# EAGLE design ADC3_FPGA (EAGLE 9.6.2)
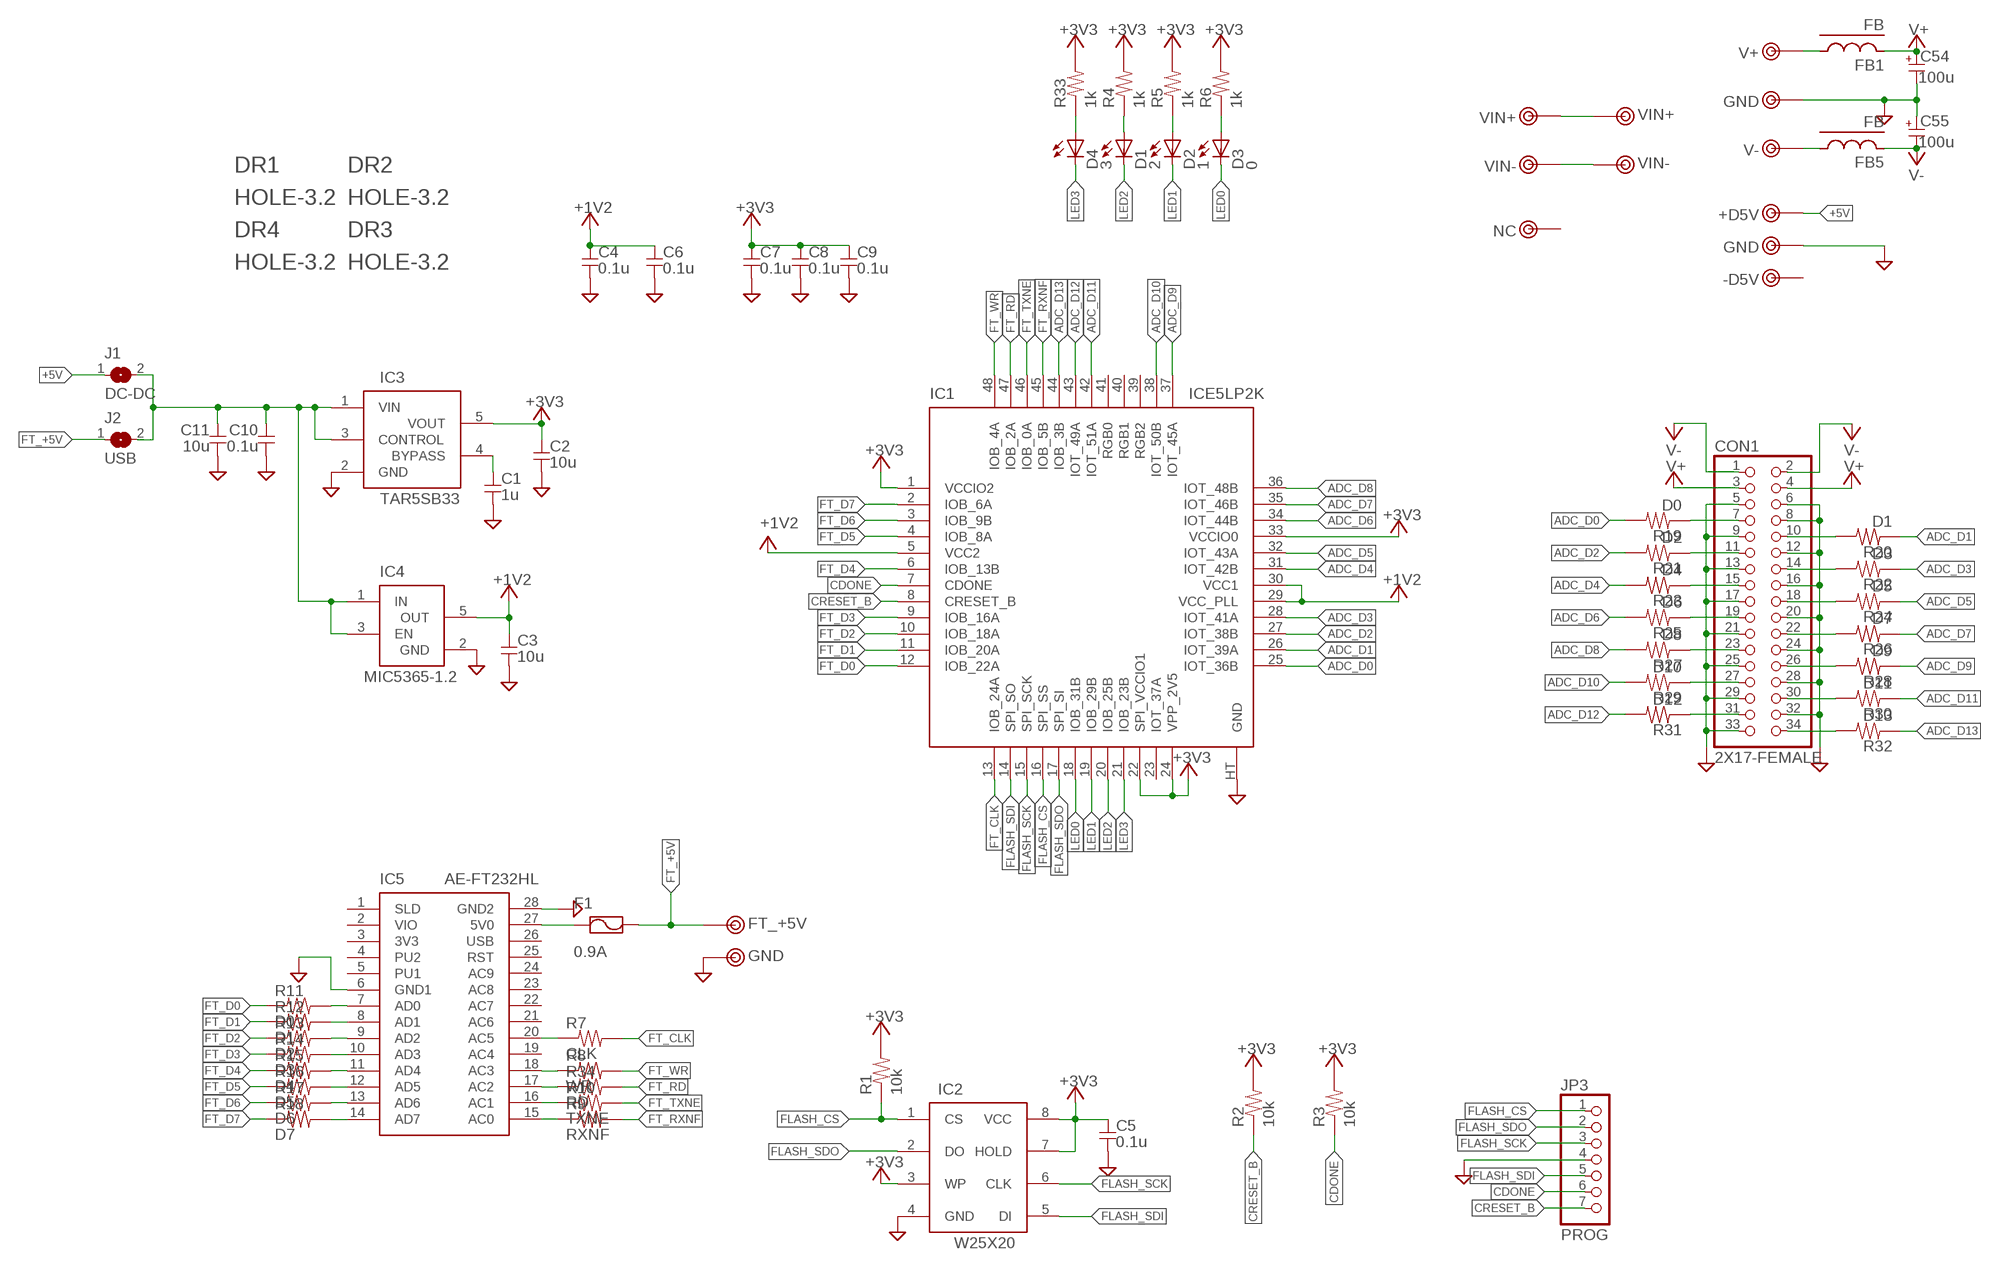
[diagram p0: schematic, sheet 1]

## Parts
C1  1u  C-1608  [1608]
C2  10u  C-2012  [2012]
C3  10u  C-2012  [2012]
C4  0.1u  C-1608  [1608]
C5  0.1u  C-1608  [1608]
C6  0.1u  C-1608  [1608]
C7  0.1u  C-1608  [1608]
C8  0.1u  C-1608  [1608]
C9  0.1u  C-1608  [1608]
C10  0.1u  C-1608  [1608]
C11  10u  C-3216  [3216]
C54  100u  CPOLE2.5-8  [E2,5-8]
C55  100u  CPOLE2.5-8  [E2,5-8]
CON1  2X17-FEMALE  [2X17/90]
D1  2  LED-SMD1608  [D1608]
D2  1  LED-SMD1608  [D1608]
D3  0  LED-SMD1608  [D1608]
D4  3  LED-SMD1608  [D1608]
DR1  HOLE-3.2  [HOLE_3.2]
DR2  HOLE-3.2  [HOLE_3.2]
DR3  HOLE-3.2  [HOLE_3.2]
DR4  HOLE-3.2  [HOLE_3.2]
F1  0.9A  FUSE-3216  [3216]
FB1  FB  FB-2012  [2012-J]
FB5  FB  FB-2012  [2012-J]
IC1  ICE5LP2K  [QFN48HT]
IC2  W25X20  EEPROM_SPI  [SOP8]
IC3  TAR5SB33  [SOT23-5]
IC4  MIC5365-1.2  MIC5365  [SC70]
IC5  AE-FT232HL  [AE-FT232HL]
J1  DC-DC  SJ-2012  [2012-J]
J2  USB  SJ-2012  [2012-J]
JP3  PROG  PINHD-1X7  [1X07]
R1  10k  R-1608  [1608]
R2  10k  R-1608  [1608]
R3  10k  R-1608  [1608]
R4  1k  R-1608  [1608]
R5  1k  R-1608  [1608]
R6  1k  R-1608  [1608]
R7  CLK  R-1608J  [1608-J]
R8  WR  R-1608J  [1608-J]
R9  RXNF  R-1608J  [1608-J]
R10  TXNE  R-1608J  [1608-J]
R11  D0  R-1608J  [1608-J]
R12  D1  R-1608J  [1608-J]
R13  D2  R-1608J  [1608-J]
R14  D3  R-1608J  [1608-J]
R15  D4  R-1608J  [1608-J]
R16  D5  R-1608J  [1608-J]
R17  D6  R-1608J  [1608-J]
R18  D7  R-1608J  [1608-J]
R19  D0  R-1608J  [1608-J]
R20  D1  R-1608J  [1608-J]
R21  D2  R-1608J  [1608-J]
R22  D3  R-1608J  [1608-J]
R23  D4  R-1608J  [1608-J]
R24  D5  R-1608J  [1608-J]
R25  D6  R-1608J  [1608-J]
R26  D7  R-1608J  [1608-J]
R27  D8  R-1608J  [1608-J]
R28  D9  R-1608J  [1608-J]
R29  D10  R-1608J  [1608-J]
R30  D11  R-1608J  [1608-J]
R31  D12  R-1608J  [1608-J]
R32  D13  R-1608J  [1608-J]
R33  1k  R-1608  [1608]
R34  RD  R-1608J  [1608-J]
TP1  +D5V  TESTPIN  [TESTPIN]
TP2  NC  TESTPIN  [TESTPIN]
TP3  GND  TESTPIN  [TESTPIN]
TP4  FT_+5V  TESTPIN  [TESTPIN]
TP5  GND  TESTPIN  [TESTPIN]
TP15  -D5V  TESTPIN  [TESTPIN]
TP17  V+  TESTPIN  [TESTPIN]
TP18  GND  TESTPIN  [TESTPIN]
TP19  V-  TESTPIN  [TESTPIN]
TP21  VIN+  TESTPIN  [TESTPIN]
TP22  VIN-  TESTPIN  [TESTPIN]
TP30  VIN+  TESTPIN  [TESTPIN]
TP31  VIN-  TESTPIN  [TESTPIN]

## Nets
+1V2: C3.1 C4.1 C6.1 IC1.5(VCC2) IC1.29(VCC_PLL) IC1.30(VCC1) IC4.5(OUT)
+3V3: C2.1 C5.1 C7.1 C8.1 C9.1 IC1.1(VCCIO2) IC1.22(SPI_VCCIO1) IC1.24(VPP_2V5) IC1.33(VCCIO0) IC2.3(WP) IC2.7(HOLD) IC2.8(VCC) IC3.5(VOUT) R1.2 R2.2 R3.2 R4.2 R5.2 R6.2 R33.2
+5V: J1.1 TP1.1
ADC_D0: IC1.25(IOT_36B) R19.2
ADC_D1: IC1.26(IOT_39A) R20.1
ADC_D2: IC1.27(IOT_38B) R21.2
ADC_D3: IC1.28(IOT_41A) R22.1
ADC_D4: IC1.31(IOT_42B) R23.2
ADC_D5: IC1.32(IOT_43A) R24.1
ADC_D6: IC1.34(IOT_44B) R25.2
ADC_D7: IC1.35(IOT_46B) R26.1
ADC_D8: IC1.36(IOT_48B) R27.2
ADC_D9: IC1.37(IOT_45A) R28.1
ADC_D10: IC1.38(IOT_50B) R29.2
ADC_D11: IC1.42(IOT_51A) R30.1
ADC_D12: IC1.43(IOT_49A) R31.2
ADC_D13: IC1.44(IOB_3B) R32.1
CDONE: IC1.7(CDONE) JP3.6 R3.1
CRESET_B: IC1.8(CRESET_B) JP3.7 R2.1
FLASH_CS: IC1.16(SPI_SS) IC2.1(CS) JP3.1 R1.1
FLASH_SCK: IC1.15(SPI_SCK) IC2.6(CLK) JP3.3
FLASH_SDI: IC1.14(SPI_SO) IC2.5(DI) JP3.5
FLASH_SDO: IC1.17(SPI_SI) IC2.2(DO) JP3.2
FT_+5V: F1.2 J2.1 TP4.1
FT_CLK: IC1.13(IOB_24A) R7.2
FT_D0: IC1.12(IOB_22A) R11.1
FT_D1: IC1.11(IOB_20A) R12.1
FT_D2: IC1.10(IOB_18A) R13.1
FT_D3: IC1.9(IOB_16A) R14.1
FT_D4: IC1.6(IOB_13B) R15.1
FT_D5: IC1.4(IOB_8A) R16.1
FT_D6: IC1.3(IOB_9B) R17.1
FT_D7: IC1.2(IOB_6A) R18.1
FT_RD: IC1.47(IOB_2A) R34.2
FT_RXNF: IC1.45(IOB_5B) R9.2
FT_TXNE: IC1.46(IOB_0A) R10.2
FT_WR: IC1.48(IOB_4A) R8.2
GND: C1.2 C2.2 C3.2 C4.2 C5.2 C6.2 C7.2 C8.2 C9.2 C10.2 C11.2 C54.- C55.+ CON1.5 CON1.6 CON1.8 CON1.9 CON1.12 CON1.13 CON1.16 CON1.17 CON1.20 CON1.21 CON1.24 CON1.25 CON1.28 CON1.29 CON1.32 CON1.33 IC1.HT(GND) IC2.4(GND) IC3.2(GND) IC4.2(GND) IC5.6(GND1) IC5.28(GND2) JP3.4 TP3.1 TP5.1 TP18.1
LED0: D3.K IC1.18(IOB_31B)
LED1: D2.K IC1.19(IOB_29B)
LED2: D1.K IC1.20(IOB_25B)
LED3: D4.K IC1.21(IOB_23B)
N$1: C1.1 IC3.4(BYPASS)
N$2: IC5.15(AC0) R9.1
N$3: D4.A R33.1
N$4: IC5.16(AC1) R10.1
N$5: IC5.18(AC3) R8.1
N$6: IC5.20(AC5) R7.1
N$7: IC5.7(AD0) R11.2
N$8: IC5.8(AD1) R12.2
N$9: IC5.9(AD2) R13.2
N$10: IC5.10(AD3) R14.2
N$11: IC5.11(AD4) R15.2
N$12: IC5.12(AD5) R16.2
N$13: IC5.13(AD6) R17.2
N$14: IC5.14(AD7) R18.2
N$15: CON1.31 R31.1
N$16: C10.1 C11.1 IC3.1(VIN) IC3.3(CONTROL) IC4.1(IN) IC4.3(EN) J1.2 J2.2
N$17: CON1.27 R29.1
N$18: CON1.23 R27.1
N$19: CON1.19 R25.1
N$20: CON1.15 R23.1
N$21: IC5.17(AC2) R34.1
N$22: F1.1 IC5.27(5V0)
N$23: D1.A R4.1
N$24: D2.A R5.1
N$25: D3.A R6.1
N$26: CON1.11 R21.1
N$27: CON1.7 R19.1
N$28: CON1.10 R20.2
N$29: CON1.14 R22.2
N$30: CON1.18 R24.2
N$31: CON1.22 R26.2
N$32: CON1.26 R28.2
N$33: CON1.30 R30.2
N$34: CON1.34 R32.2
N$70: FB1.1 TP17.1
N$71: FB5.1 TP19.1
N$75: TP21.1 TP30.1
N$76: TP22.1 TP31.1
V+: C54.+ CON1.3 CON1.4 FB1.2
V-: C55.- CON1.1 CON1.2 FB5.2
Unconnected: IC1.23(IOT_37A) IC1.39(RGB2) IC1.40(RGB1) IC1.41(RGB0) IC5.1(SLD) IC5.2(VIO) IC5.3(3V3) IC5.4(PU2) IC5.5(PU1) IC5.19(AC4) IC5.21(AC6) IC5.22(AC7) IC5.23(AC8) IC5.24(AC9) IC5.25(RST) IC5.26(USB) TP2.1 TP15.1

## Library data of the parts
C1-C11 = my_rcl:C
C54 C55 = my_rcl:CPOL
CON1 = my_connector:2X17-FEMALE
D1-D4 = my_rcl:LED
DR1-DR4 = my_connector:HOLE-3.2
F1 = my_rcl:FUSE
FB1 FB5 = my_rcl:FB
IC1 = my_ic:ICE5LP2K
IC2 = my_ic:EEPROM_SPI
IC3 = my_ic:TAR5SB33
IC4 = my_ic:MIC5365
IC5 = my_ic:AE-FT232HL
J1 J2 = my_rcl:SJ
JP3 = my_connector:PINHD-1X7: PIN HEADER
R1-R34 = my_rcl:R
TP1-TP5 TP15 TP17-TP19 TP21 TP22 TP30 TP31 = my_connector:TESTPIN

## Board
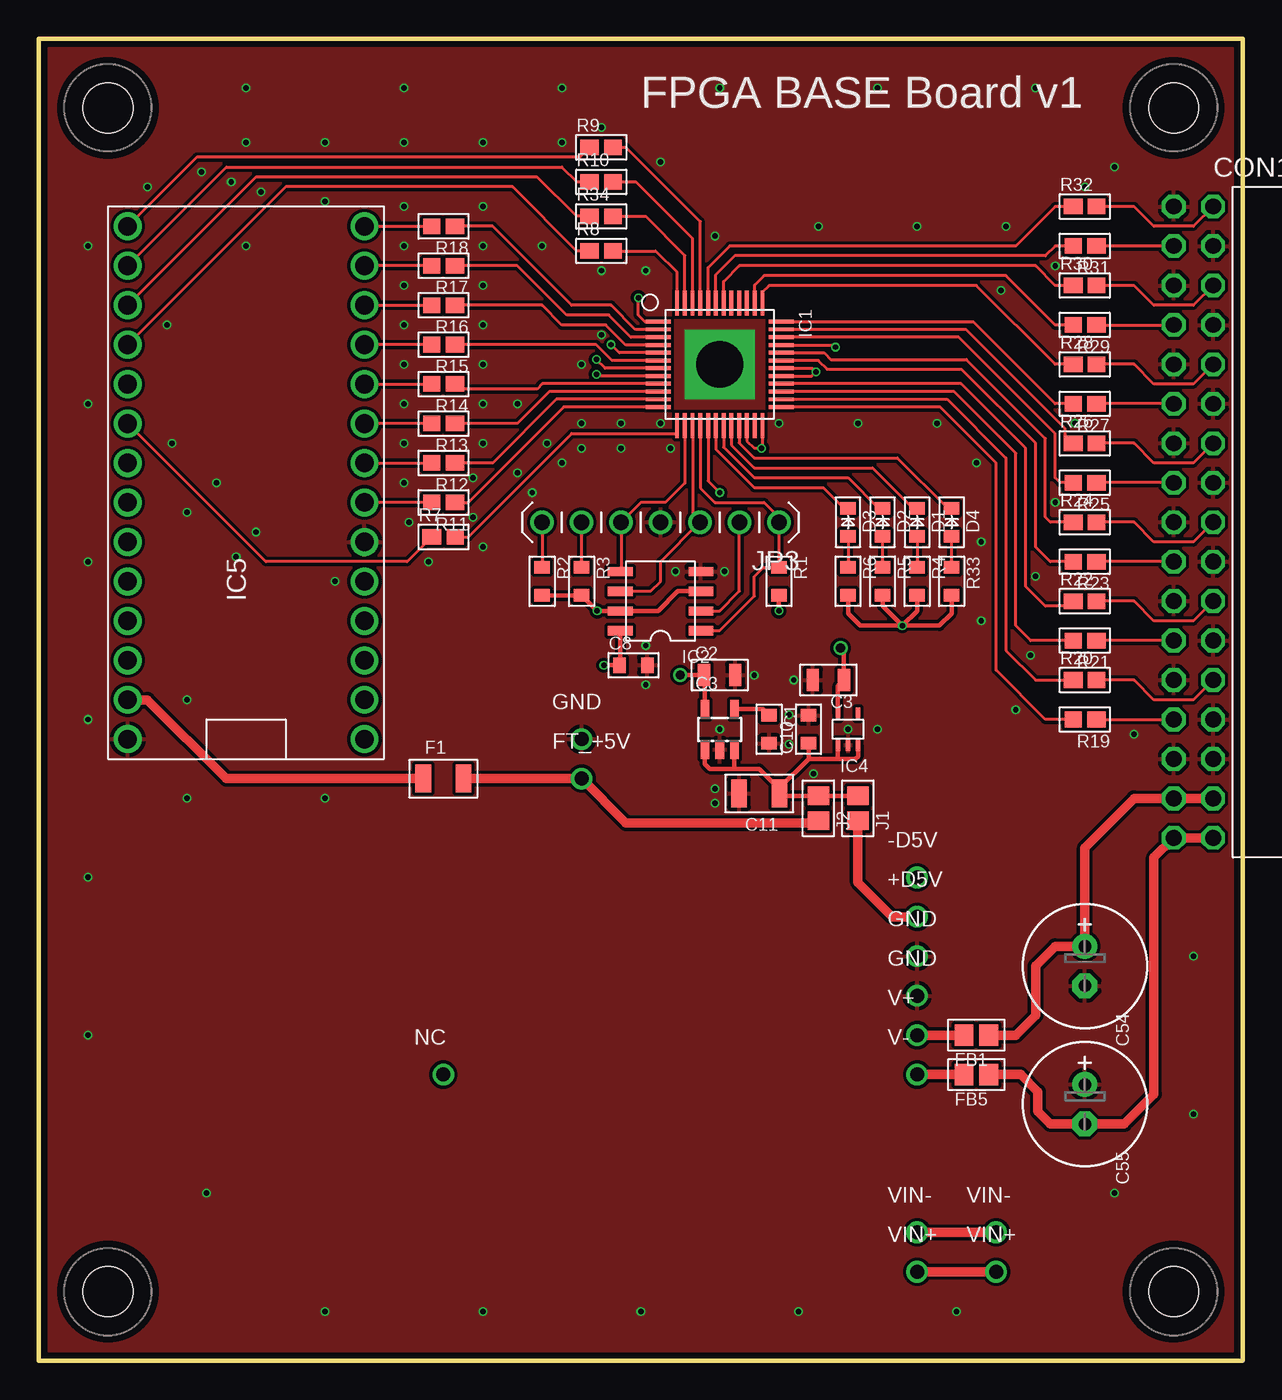
[diagram p1: board, top side]
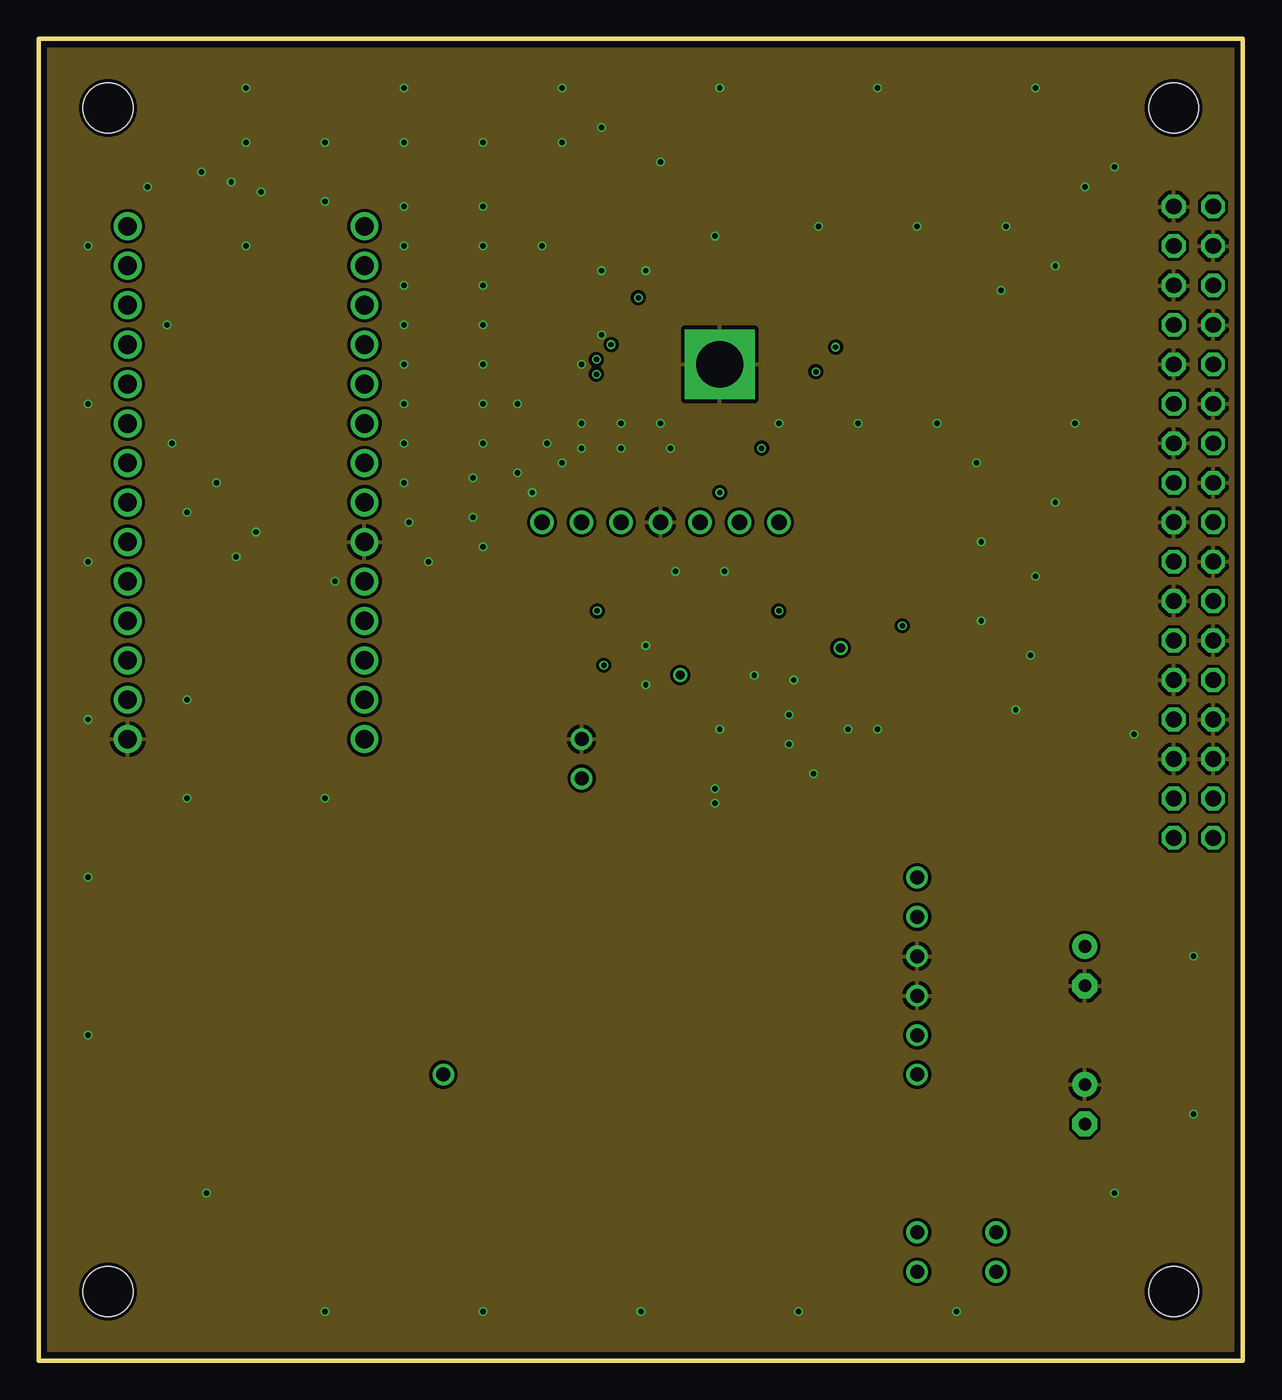
[diagram p2: board, inner layer Route2]
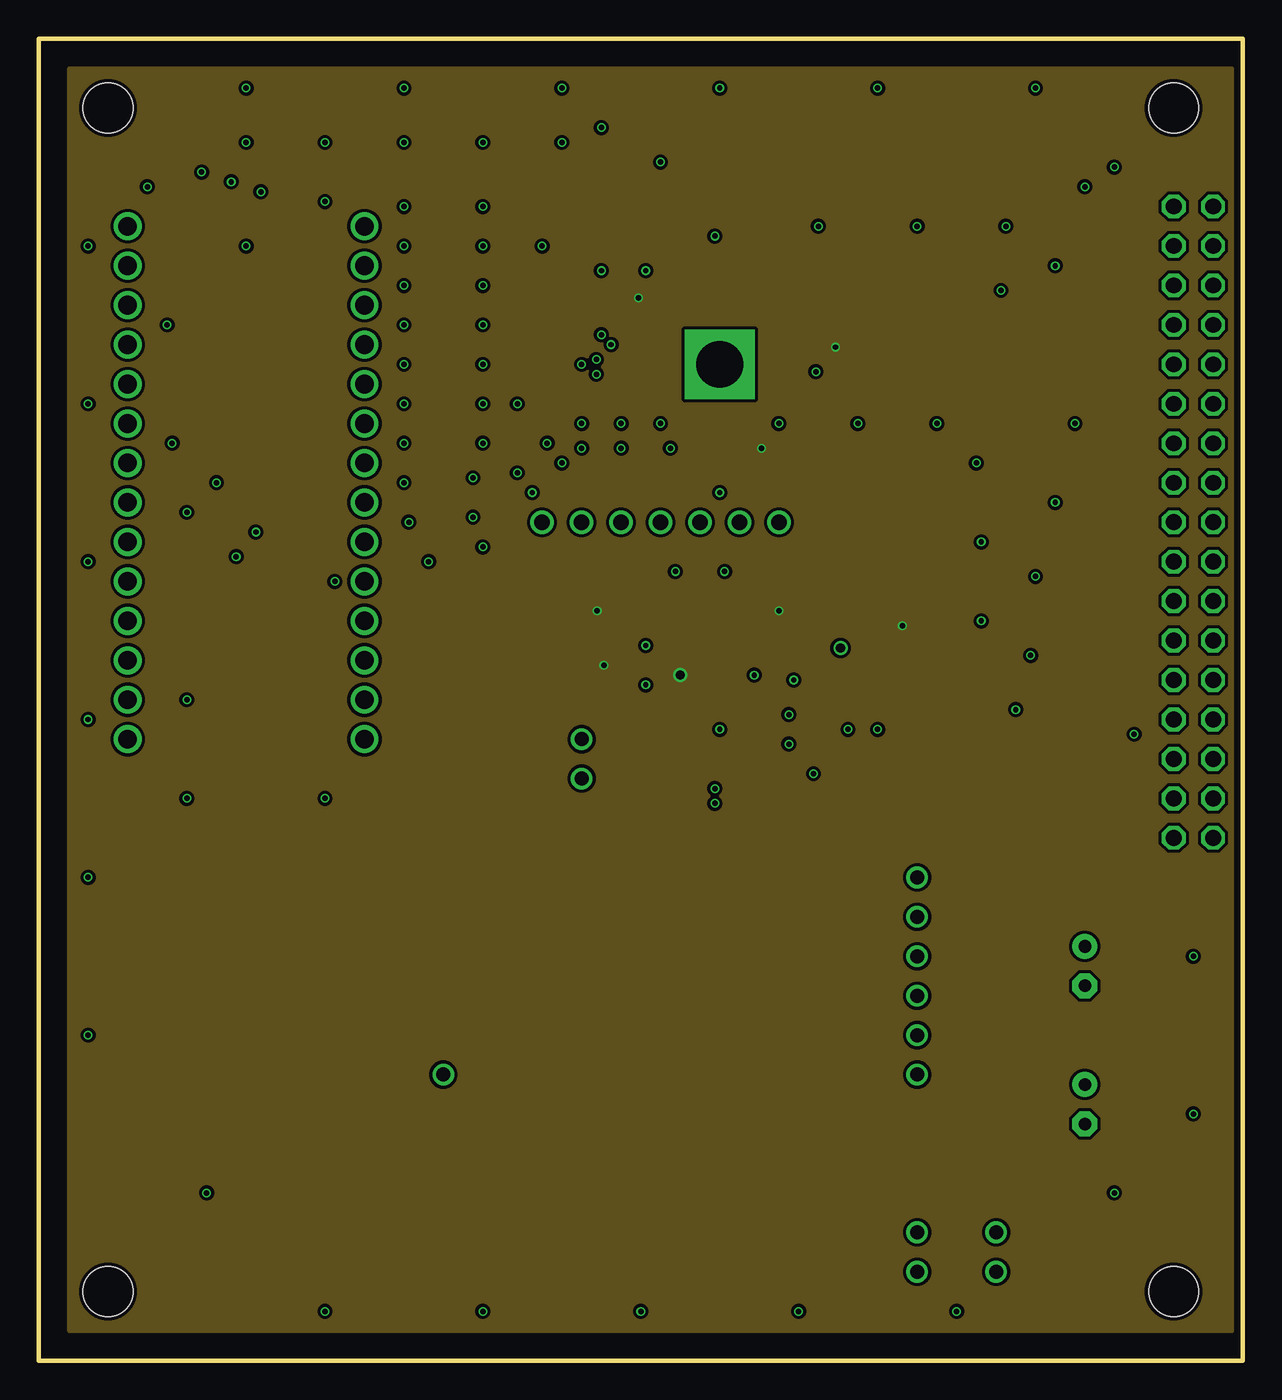
[diagram p3: board, inner layer Route15]
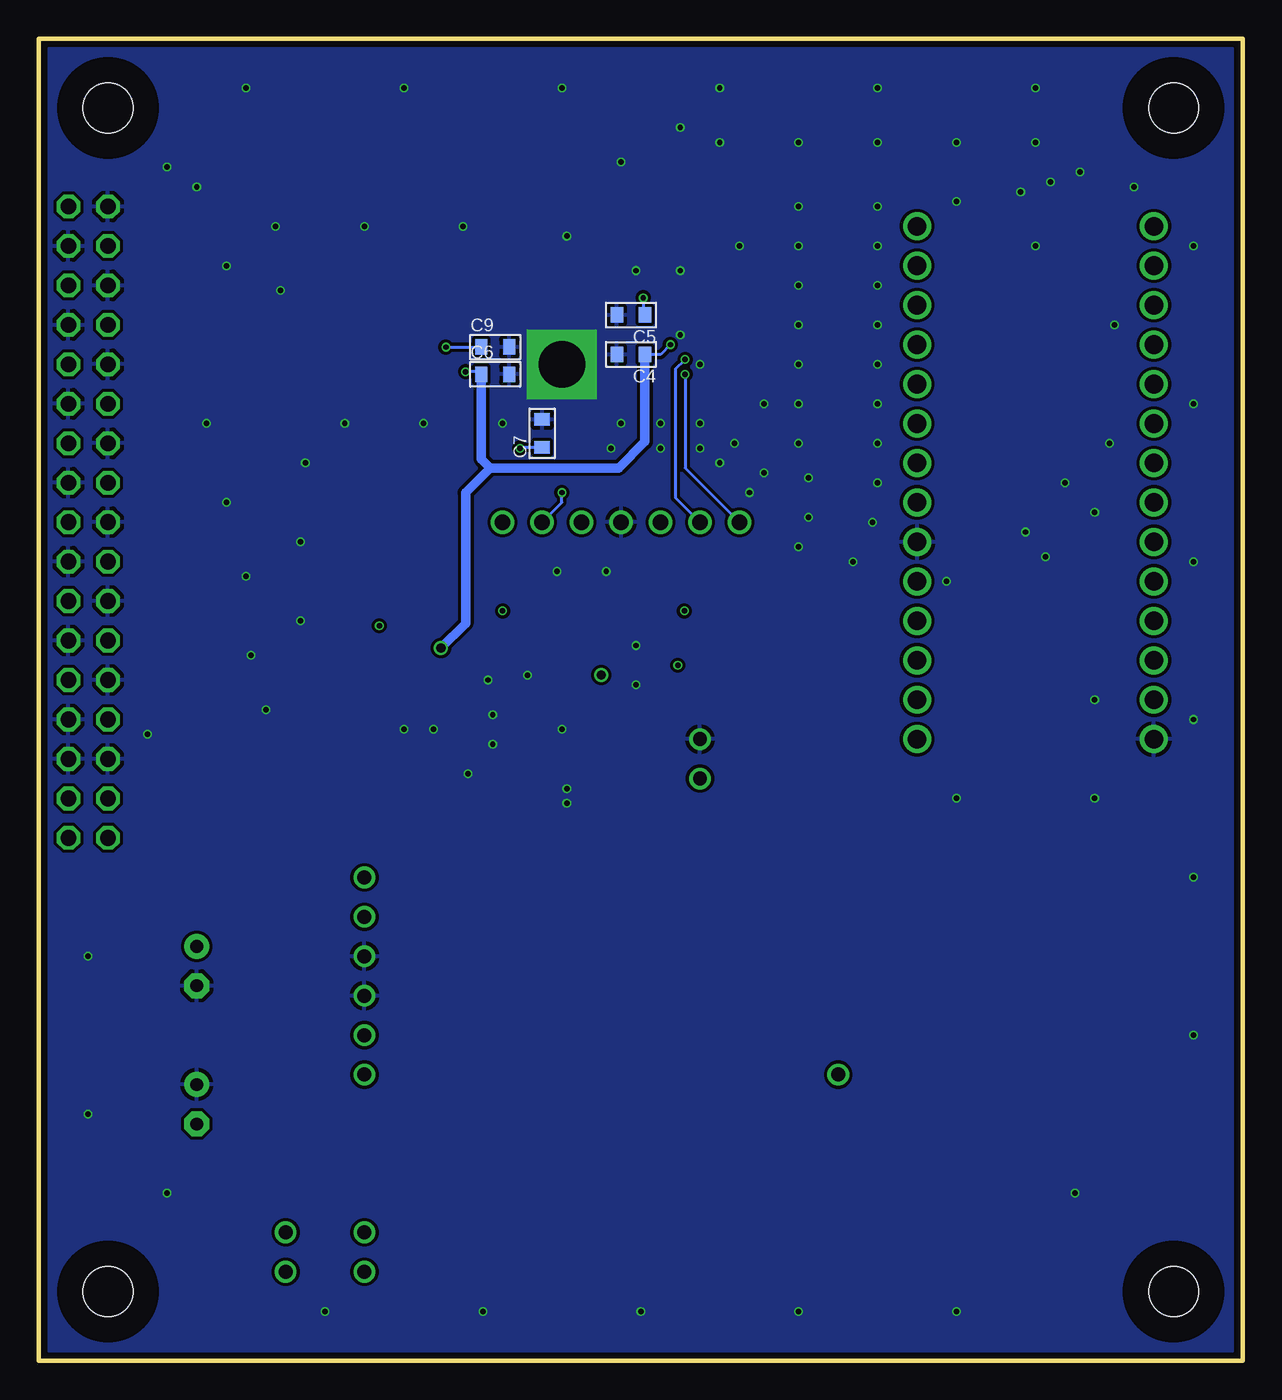
[diagram p4: board, bottom side, seen from below]

Size 77.47 x 85.09 mm. Coordinates in mm from the lower left corner, seen from the top.
Outline: 0,0 0,85.09 77.47,85.09 77.47,0 0,0
Copper layers (1*2*15*16): Top 0.035mm / dielectric 0.2mm / Route2 0.0175mm / dielectric 0.3mm / Route15 0.0175mm / dielectric 0.2mm / Bottom 0.035mm
Design rules "SeeedStudio_4layer_DRU_20140221 *": minimum track width 6mil, minimum drill 12mil, track to track 6mil, track to pad 6mil, pad to pad 6mil, via to via 6mil, smd to smd 0mil, copper to edge 10mil, drill to drill 8mil, minimum pad ring 6mil, minimum via ring 4mil, stop-mask expansion 4mil, vias tented up to drill 1mm, thermal gap 10mil

### Footprints (pad centres in the part's own frame; a part is rotated, then mirrored left to right if it is on the bottom)
1608 = smd 0.8 x 1: 1 -0.9,0; 2 0.9,0
2012 = smd 0.8 x 1.4: 1 -1,0; 2 1,0
3216 = smd 1 x 1.8: 1 -1.3,0; 2 1.3,0
E2,5-8 = drill 0.813 pad 1.6: + -1.27,0 | drill 0.813 pad 1.6 octagon: - 1.27,0
2X17/90 = drill 1.016 octagon: 1 20.32,-6.35; 2 20.32,-3.81; 3 17.78,-6.35; 4 17.78,-3.81; 5 15.24,-6.35; 6 15.24,-3.81; 7 12.7,-6.35; 8 12.7,-3.81; 9 10.16,-6.35; 10 10.16,-3.81; 11 7.62,-6.35; 12 7.62,-3.81; 13 5.08,-6.35; 14 5.08,-3.81; 15 2.54,-6.35; 16 2.54,-3.81; 17 0,-6.35; 18 0,-3.81; 19 -2.54,-6.35; 20 -2.54,-3.81; 21 -5.08,-6.35; 22 -5.08,-3.81; 23 -7.62,-6.35; 24 -7.62,-3.81; 25 -10.16,-6.35; 26 -10.16,-3.81; 27 -12.7,-6.35; 28 -12.7,-3.81; 29 -15.24,-6.35; 30 -15.24,-3.81; 31 -17.78,-6.35; 32 -17.78,-3.81; 33 -20.32,-6.35; 34 -20.32,-3.81
D1608 = smd 0.8 x 1: A 0.9,0; K -0.9,0
HOLE_3.2 = hole 3.2: 0,0
2012-J = smd 1.2 x 1.4: 1 -0.8,0; 2 0.8,0
QFN48HT = smd 0.25 x 1.6: 1 -2.75,-3.95; 2 -2.25,-3.95; 3 -1.75,-3.95; 4 -1.25,-3.95; 5 -0.75,-3.95; 6 -0.25,-3.95; 7 0.25,-3.95; 8 0.75,-3.95; 9 1.25,-3.95; 10 1.75,-3.95; 11 2.25,-3.95; 12 2.75,-3.95; 25 2.75,3.95; 26 2.25,3.95; 27 1.75,3.95; 28 1.25,3.95; 29 0.75,3.95; 30 0.25,3.95; 31 -0.25,3.95; 32 -0.75,3.95; 33 -1.25,3.95; 34 -1.75,3.95; 35 -2.25,3.95; 36 -2.75,3.95 | smd 1.6 x 0.25: 13 3.95,-2.75; 14 3.95,-2.25; 15 3.95,-1.75; 16 3.95,-1.25; 17 3.95,-0.75; 18 3.95,-0.25; 19 3.95,0.25; 20 3.95,0.75; 21 3.95,1.25; 22 3.95,1.75; 23 3.95,2.25; 24 3.95,2.75; 37 -3.95,2.75; 38 -3.95,2.25; 39 -3.95,1.75; 40 -3.95,1.25; 41 -3.95,0.75; 42 -3.95,0.25; 43 -3.95,-0.25; 44 -3.95,-0.75; 45 -3.95,-1.25; 46 -3.95,-1.75; 47 -3.95,-2.25; 48 -3.95,-2.75 | drill 3 pad 4.5 square: HT 0,0
SOP8 = smd 0.6 x 1.6: 1 -1.905,-2.6; 2 -0.635,-2.6; 3 0.635,-2.6; 4 1.905,-2.6; 5 1.905,2.6; 6 0.635,2.6; 7 -0.635,2.6; 8 -1.905,2.6
SOT23-5 = smd 0.55 x 1.2: 1 -0.95,-1.3; 2 0,-1.3; 3 0.95,-1.3; 4 0.95,1.3; 5 -0.95,1.3
SC70 = smd 0.3 x 0.8: 1 0.65,1; 2 0,1; 3 -0.65,1; 4 -0.65,-1; 5 0.65,-1
AE-FT232HL = drill 1.2: 1 -16.51,-7.62; 2 -13.97,-7.62; 3 -11.43,-7.62; 4 -8.89,-7.62; 5 -6.35,-7.62; 6 -3.81,-7.62; 7 -1.27,-7.62; 8 1.27,-7.62; 9 3.81,-7.62; 10 6.35,-7.62; 11 8.89,-7.62; 12 11.43,-7.62; 13 13.97,-7.62; 14 16.51,-7.62; 15 16.51,7.62; 16 13.97,7.62; 17 11.43,7.62; 18 8.89,7.62; 19 6.35,7.62; 20 3.81,7.62; 21 1.27,7.62; 22 -1.27,7.62; 23 -3.81,7.62; 24 -6.35,7.62; 25 -8.89,7.62; 26 -11.43,7.62; 27 -13.97,7.62; 28 -16.51,7.62
1X07 = drill 1: 1 -7.62,0; 2 -5.08,0; 3 -2.54,0; 4 0,0; 5 2.54,0; 6 5.08,0; 7 7.62,0
1608-J = smd 1.2 x 1: 1 -0.75,0 | smd 1.1 x 1: 2 0.75,0
TESTPIN = drill 0.9 pad 1.4: 1 0,0

### Placement (x,y rotation side)
C1  46.99,40.64 270 top
C2  43.81,44.13 0 top
C3  50.8,43.81 180 top
C4  39.37,64.77 180 bottom
C5  39.37,67.31 180 bottom
C6  48.1,63.5 0 bottom
C7  45.09,59.69 90 bottom
C8  38.26,44.77 0 top
C9  48.1,65.25 0 bottom
C10  49.53,40.64 90 top
C11  46.35,36.51 180 top
C54  67.31,25.4 270 top
C55  67.31,16.51 270 top
CON1  79.38,53.98 270 top
D1  56.52,53.98 270 top
D2  54.29,53.98 270 top
D3  52.07,53.98 270 top
D4  58.74,53.98 270 top
DR1  4.45,4.45 0 top
DR2  73.03,4.45 0 top
DR3  73.03,80.65 0 top
DR4  4.45,80.65 0 top
F1  26.04,37.46 0 top
FB1  60.32,20.96 0 top
FB5  60.32,18.42 0 top
IC1  43.81,64.14 270 top
IC2  40,48.89 90 top
IC3  43.81,40.64 0 top
IC4  52.07,40.64 180 top
IC5  13.33,56.52 90 top
J1  52.7,35.56 90 top
J2  50.16,35.56 90 top
JP3  40,53.98 180 top
R1  47.62,50.16 270 top
R2  32.38,50.16 270 top
R3  34.92,50.16 270 top
R4  56.52,50.16 270 top
R5  54.29,50.16 270 top
R6  52.07,50.16 270 top
R7  26.04,53.02 0 top
R8  36.2,71.44 0 top
R9  36.2,78.11 0 top
R10  36.2,75.88 0 top
R11  26.04,55.24 180 top
R12  26.04,57.78 180 top
R13  26.04,60.32 180 top
R14  26.04,62.86 180 top
R15  26.04,65.41 180 top
R16  26.04,67.95 180 top
R17  26.04,70.48 180 top
R18  26.04,73.03 180 top
R19  67.31,41.27 180 top
R20  67.31,43.81 0 top
R21  67.31,46.35 180 top
R22  67.31,48.89 0 top
R23  67.31,51.43 180 top
R24  67.31,53.98 0 top
R25  67.31,56.52 180 top
R26  67.31,59.05 0 top
R27  67.31,61.59 180 top
R28  67.31,64.14 0 top
R29  67.31,66.68 180 top
R30  67.31,69.22 0 top
R31  67.31,71.76 180 top
R32  67.31,74.3 0 top
R33  58.74,50.16 270 top
R34  36.2,73.66 0 top
TP1  56.52,28.58 0 top
TP2  26.04,18.42 0 top
TP3  56.52,26.04 0 top
TP4  34.92,37.46 0 top
TP5  34.92,40 0 top
TP15  56.52,31.12 0 top
TP17  56.52,20.96 0 top
TP18  56.52,23.5 0 top
TP19  56.52,18.42 0 top
TP21  56.52,5.71 0 top
TP22  56.52,8.26 0 top
TP30  61.59,5.71 0 top
TP31  61.59,8.26 0 top

### Tracks (layer width: path | path; a pad name or v marks a point on that pad's centre or on a via)
+1V2  (via drill 0.35, 0.6)
  Top 0.203: IC1.5 37.35,64.89 v36.83,65.41 | IC1.30 49.78,63.88 v50.01,63.66 49.73,63.38 IC1.29
  Top 0.305: IC4.5 51.42,43.43 C3.1 51.8,45.67 v51.59,45.88
  Bottom 0.203: v36.83,65.41 37.46,64.77 C4.1 | C6.1 49.16,63.66 v50.01,63.66
  Bottom 0.61: C4.1 38.47,59.16 40.16,57.47 48.42,57.47 | 48.42,57.47 50.01,55.88 50.01,47.47 v51.59,45.88 | C6.1 49,58.05 48.42,57.47
+3V3  (via drill 0.35, 0.6)
  Top 0.203: IC1.1 39,66.89 38.58,67.31 v38.58,68.42 | IC1.33 51.14,65.39 v51.28,65.25 | IC1.22 45.56,59.21 46.04,58.74 v46.51,58.74 46.56,58.79 IC1.24
  Top 0.305: R2.2 R3.2 v35.93,48.26 IC2.7 39.85,48.26 41.12,49.53 IC2.3 | IC2.8 37.41,44.81 C8.1 v36.35,44.77 | R1.2 v47.62,48.26 | R5.2 54.29,48.58 v55.56,47.31 | R4.2 56.52,48.26 v55.56,47.31 | R6.2 52.07,48.1 52.86,47.31 v55.56,47.31 | R33.2 58.74,48.1 57.94,47.31 v55.56,47.31 | IC3.5 42.86,44.08 C2.1 v41.27,44.13
  Bottom 0.203: v38.58,68.42 38.58,67.42 C5.1 | v51.28,65.25 C9.1 | C7.1 46.46,58.79 v46.51,58.74
  pour Route15 (isolate 0.203): 1.91,83.19 1.91,1.91 76.84,1.91 76.84,83.19
+5V
  Top 0.61: TP1.1 54.93,28.58 52.7,30.8 J1.1
ADC_D0
  Top 0.203: R19.2 64.77,41.27 61.59,44.45 61.59,57.78 57.99,61.38 IC1.25
ADC_D1
  Top 0.203: R20.1 64.14,43.81 62.23,45.72 62.23,58.1 58.45,61.88 IC1.26
ADC_D2
  Top 0.203: R21.2 63.82,46.35 62.86,47.31 62.86,58.42 58.9,62.38 IC1.27
ADC_D3
  Top 0.203: R22.1 66.24,48.58 64.77,48.58 63.5,49.85 63.5,58.74 59.35,62.88 IC1.28
ADC_D4
  Top 0.203: R23.2 65.09,51.43 64.14,52.39 64.14,59.05 59.37,63.82 50.73,63.82 50.16,64.39 IC1.31
ADC_D5
  Top 0.203: R24.1 65.09,53.98 64.77,54.29 64.77,59.37 59.69,64.45 50.96,64.45 50.53,64.89 IC1.32
ADC_D6
  Top 0.203: R25.2 65.72,56.52 65.41,56.83 65.41,59.69 59.21,65.89 IC1.34
ADC_D7
  Top 0.203: R26.1 66.04,59.57 66.04,60.01 59.66,66.39 IC1.35
ADC_D8
  Top 0.203: IC1.36 60.11,66.89 65.41,61.59 R27.2
ADC_D9
  Top 0.203: IC1.37 46.56,68.79 46.99,69.22 60.32,69.22 65.41,64.14 R28.1
ADC_D10
  Top 0.203: IC1.38 46.06,69.24 46.67,69.85 62.23,69.85 65.41,66.68 R29.2
ADC_D11
  Top 0.203: IC1.42 44.06,69.47 45.09,70.48 64.14,70.48 65.41,69.22 R30.1
ADC_D12
  Top 0.203: IC1.43 43.56,69.92 44.77,71.12 64.77,71.12 65.41,71.76 R31.2
ADC_D13
  Top 0.203: IC1.44 43.06,70.37 44.45,71.76 62.86,71.76 65.41,74.3 R32.1
CDONE  (via drill 0.35)
  Top 0.203: IC1.7 36.45,63.88 v35.88,64.45 | R3.1 JP3.6
  Bottom 0.203: JP3.6 36.51,55.56 36.51,63.82 v35.88,64.45
CRESET_B  (via drill 0.35)
  Top 0.203: IC1.8 35.99,63.38 v35.88,63.5 | JP3.7 R2.1
  Bottom 0.203: JP3.7 35.88,57.47 v35.88,63.5
FLASH_CS
  Top 0.203: IC1.16 42.56,56.18 43.5,55.24 46.67,55.24 47.62,54.29 JP3.1 R1.1 46.62,51.06 46.04,50.48 46.04,49.21 43.81,46.99 IC2.1
FLASH_SCK
  Top 0.203: IC1.15 42.06,54.45 JP3.3 40,51.43 40,50.16 39.37,49.53 IC2.6
FLASH_SDI
  Top 0.203: IC1.14 41.56,56.49 40.32,55.24 38.73,55.24 JP3.5 37.46,50.86 IC2.5
FLASH_SDO  (via drill 0.35)
  Top 0.203: IC1.17 43.06,56.63 v43.81,55.88 | IC2.2 43.81,48.26 45.09,49.53 JP3.2
  Bottom 0.203: JP3.2 43.81,55.24 v43.81,55.88
FT_+5V
  Top 0.61: F1.2 TP4.1 37.78,34.61 50.01,34.61 J2.1
FT_CLK
  Top 0.203: R7.2 27.62,53.02 34.29,59.69 41.06,59.69 IC1.13
FT_D0
  Top 0.203: R11.1 27.62,55.24 33.76,61.38 IC1.12
FT_D1
  Top 0.203: IC1.11 33.31,61.88 29.21,57.78 R12.1
FT_D2
  Top 0.203: IC1.10 32.86,62.38 30.8,60.32 R13.1
FT_D3
  Top 0.203: IC1.9 32.41,62.88 32.07,62.55 27.1,62.55 R14.1
FT_D4
  Top 0.203: IC1.6 36.9,64.39 35.88,65.41 R15.1
FT_D5
  Top 0.203: IC1.4 37.78,65.39 36.49,66.68 33.66,66.68 32.38,67.95 R16.1
FT_D6
  Top 0.203: IC1.3 38.1,65.89 36.67,67.31 33.97,67.31 30.8,70.48 R17.1
FT_D7
  Top 0.203: R18.1 29.21,73.03 34.29,67.95 36.83,67.95 38.39,66.39 IC1.2
FT_RD
  Top 0.203: R34.2 39.05,73.66 41.56,71.15 IC1.47
FT_RXNF
  Top 0.203: IC1.45 42.56,73.32 37.78,78.11 R9.2
FT_TXNE
  Top 0.203: IC1.46 42.06,72.23 38.42,75.88 R10.2
FT_WR
  Top 0.203: R8.2 39.69,71.44 41.06,70.06 IC1.48
GND  (via drill 0.35)
  other vias: 40,60.32 37.46,60.32 34.92,60.32 32.7,59.05 30.8,57.15 27.94,54.29 23.81,53.98 40.64,58.74 37.46,58.74 34.92,58.74 33.66,57.78 31.75,55.88 28.58,52.39 25.08,51.43 30.8,61.59 23.5,61.59 23.5,59.05 23.5,56.52 23.5,64.14 23.5,66.68 23.5,69.22 23.5,71.76 23.5,74.3 28.58,71.76 28.58,69.22 28.58,66.68 28.58,64.14 28.58,61.59 28.58,59.05 27.94,56.83 34.92,64.14 36.2,66.04 28.58,74.3 32.38,71.76 39.05,70.17 43.5,72.39 40,77.15 33.66,78.42 28.58,78.42 23.5,78.42 18.42,78.42 18.42,74.61 13.33,78.42 13.33,71.76 6.98,75.57 8.26,66.68 19.05,50.16 13.97,53.34 12.7,51.75 11.43,56.52 9.53,54.61 8.57,59.05 9.53,36.2 18.42,36.2 46.04,44.13 48.58,43.81 43.81,40.64 52.07,40.64 48.26,39.69 48.26,41.59 43.5,36.83 43.5,35.88 53.98,40.64 49.85,37.78 44.13,50.8 40.96,50.8 39.05,46.04 39.05,43.5 61.91,68.9 50.16,73.03 56.52,73.03 62.23,73.03 67.31,75.57 65.41,70.48 66.68,60.32 65.41,55.24 64.14,50.48 63.82,45.4 70.48,40.32 62.86,41.91 60.64,47.62 60.64,52.7 60.32,57.78 57.78,60.32 52.7,60.32 47.62,60.32 36.2,79.38 36.2,70.17 10.48,76.52 12.38,75.88 14.29,75.25 9.53,42.54 69.22,76.84 64.14,81.92 53.98,81.92 43.81,81.92 33.66,81.92 23.5,81.92 13.33,81.92 3.17,71.76 3.17,61.59 3.17,51.43 3.17,41.27 3.17,31.12 3.17,20.96 10.79,10.79 18.42,3.17 28.58,3.17 38.73,3.17 48.89,3.17 59.05,3.17 69.22,10.79 74.3,15.88 74.3,26.04
  pour Top (isolate 0.203): 0.64,84.45 0.64,0.64 76.84,0.64 76.84,84.45
  pour Bottom (isolate 0.203): 0.64,84.45 76.84,84.45 76.84,0.64 0.64,0.64
  pour Route2 (isolate 0.203): 0.64,84.45 76.84,84.45 76.84,0.64 0.64,0.64
  pour Top (isolate 0.203, no thermals): 41.27,66.68 41.27,61.59 46.35,61.59 46.35,66.68
  pour Bottom (isolate 0.203, no thermals): 41.27,66.68 41.27,61.59 46.35,61.59 46.35,66.68
LED0
  Top 0.203: IC1.18 43.56,58.67 46.04,56.2 50.48,56.2 51.8,54.88 D3.K
LED1
  Top 0.203: IC1.19 44.06,58.8 46.04,56.83 52.07,56.83 54.03,54.88 D2.K
LED2
  Top 0.203: IC1.20 44.56,58.94 46.04,57.47 53.66,57.47 56.25,54.88 D1.K
LED3
  Top 0.203: IC1.21 45.06,59.07 46.04,58.1 55.24,58.1 58.47,54.88 D4.K
N$1
  Top 0.305: IC3.4 46.59,41.94 C1.1
N$2
  Top 0.203: IC5.15 10.16,77.47 34.81,77.47 R9.1
N$3
  Top 0.203: R33.1 D4.A
N$4
  Top 0.203: IC5.16 12.06,76.84 33.66,76.84 34.61,75.88 R10.1
N$5
  Top 0.203: R8.1 34.61,71.44 30.48,75.57 15.88,75.57 IC5.18
N$6
  Top 0.203: R7.1 23.7,51.43 14.61,51.43 IC5.20
N$7
  Top 0.203: R11.2 IC5.7
N$8
  Top 0.203: IC5.8 R12.2
N$9
  Top 0.203: R13.2 IC5.9
N$10
  Top 0.203: IC5.10 R14.2
N$11
  Top 0.203: R15.2 IC5.11
N$12
  Top 0.203: IC5.12 R16.2
N$13
  Top 0.203: R17.2 IC5.13
N$14
  Top 0.203: IC5.14 R18.2
N$15
  Top 0.203: CON1.31 R31.1
N$16
  Top 0.305: IC3.1 42.86,38.41 43.18,38.1 44.77,38.1 | IC4.3 52.72,38.91 52.55,38.73 51.43,38.73 51.42,38.75 | IC4.1 51.42,38.75 | J1.2 J2.2 47.81,36.36 | 47.81,36.36 47.65,36.36 47.65,36.81 46.35,38.1 44.77,38.1 | 47.81,36.36 C11.1 47.66,36.86 49.53,38.73 | 44.77,38.1 IC3.3 | 49.53,38.73 C10.1 | 51.42,38.75 51.41,38.73 49.53,38.73
N$17
  Top 0.203: R29.1 CON1.27
N$18
  Top 0.203: CON1.23 R27.1
N$19
  Top 0.203: CON1.19 R25.1
N$20
  Top 0.203: CON1.15 R23.1
N$21
  Top 0.203: R34.1 34.61,73.66 32.07,76.2 13.97,76.2 IC5.17
N$22
  Top 0.61: IC5.27 6.98,42.54 12.06,37.46 F1.1
N$23
  Top 0.203: D1.A R4.1
N$24
  Top 0.203: R5.1 D2.A
N$25
  Top 0.203: D3.A R6.1
N$26
  Top 0.203: CON1.11 R21.1
N$27
  Top 0.203: R19.1 CON1.7
N$28
  Top 0.203: CON1.10 74.3,42.54 71.76,42.54 70.48,43.81 R20.2
N$29
  Top 0.203: CON1.14 74.3,47.62 71.76,47.62 70.48,48.89 R22.2
N$30
  Top 0.203: CON1.18 74.3,52.7 71.76,52.7 70.48,53.98 R24.2
N$31
  Top 0.203: CON1.22 74.3,57.78 71.76,57.78 70.48,59.05 R26.2
N$32
  Top 0.203: CON1.26 74.3,62.86 71.76,62.86 70.48,64.14 R28.2
N$33
  Top 0.203: CON1.30 74.3,67.95 71.76,67.95 70.48,69.22 R30.2
N$34
  Top 0.203: CON1.34 74.3,73.03 71.76,73.03 70.48,74.3 R32.2
N$70
  Top 0.61: FB1.1 TP17.1
N$71
  Top 0.61: TP19.1 FB5.1
N$75
  Top 0.61: TP30.1 TP21.1
N$76
  Top 0.61: TP22.1 TP31.1
V+
  Top 0.61: FB1.2 62.86,20.96 64.14,22.23 64.14,25.4 65.41,26.67 C54.+ 67.31,33.02 70.48,36.2 CON1.3 CON1.4
V-
  Top 0.61: FB5.2 63.18,18.42 64.29,17.3 64.29,16.03 65.09,15.24 C55.- 69.85,15.24 71.76,17.15 71.76,32.38 CON1.1 CON1.2

### Text on the board
tPlace: FPGA BASE Board v1